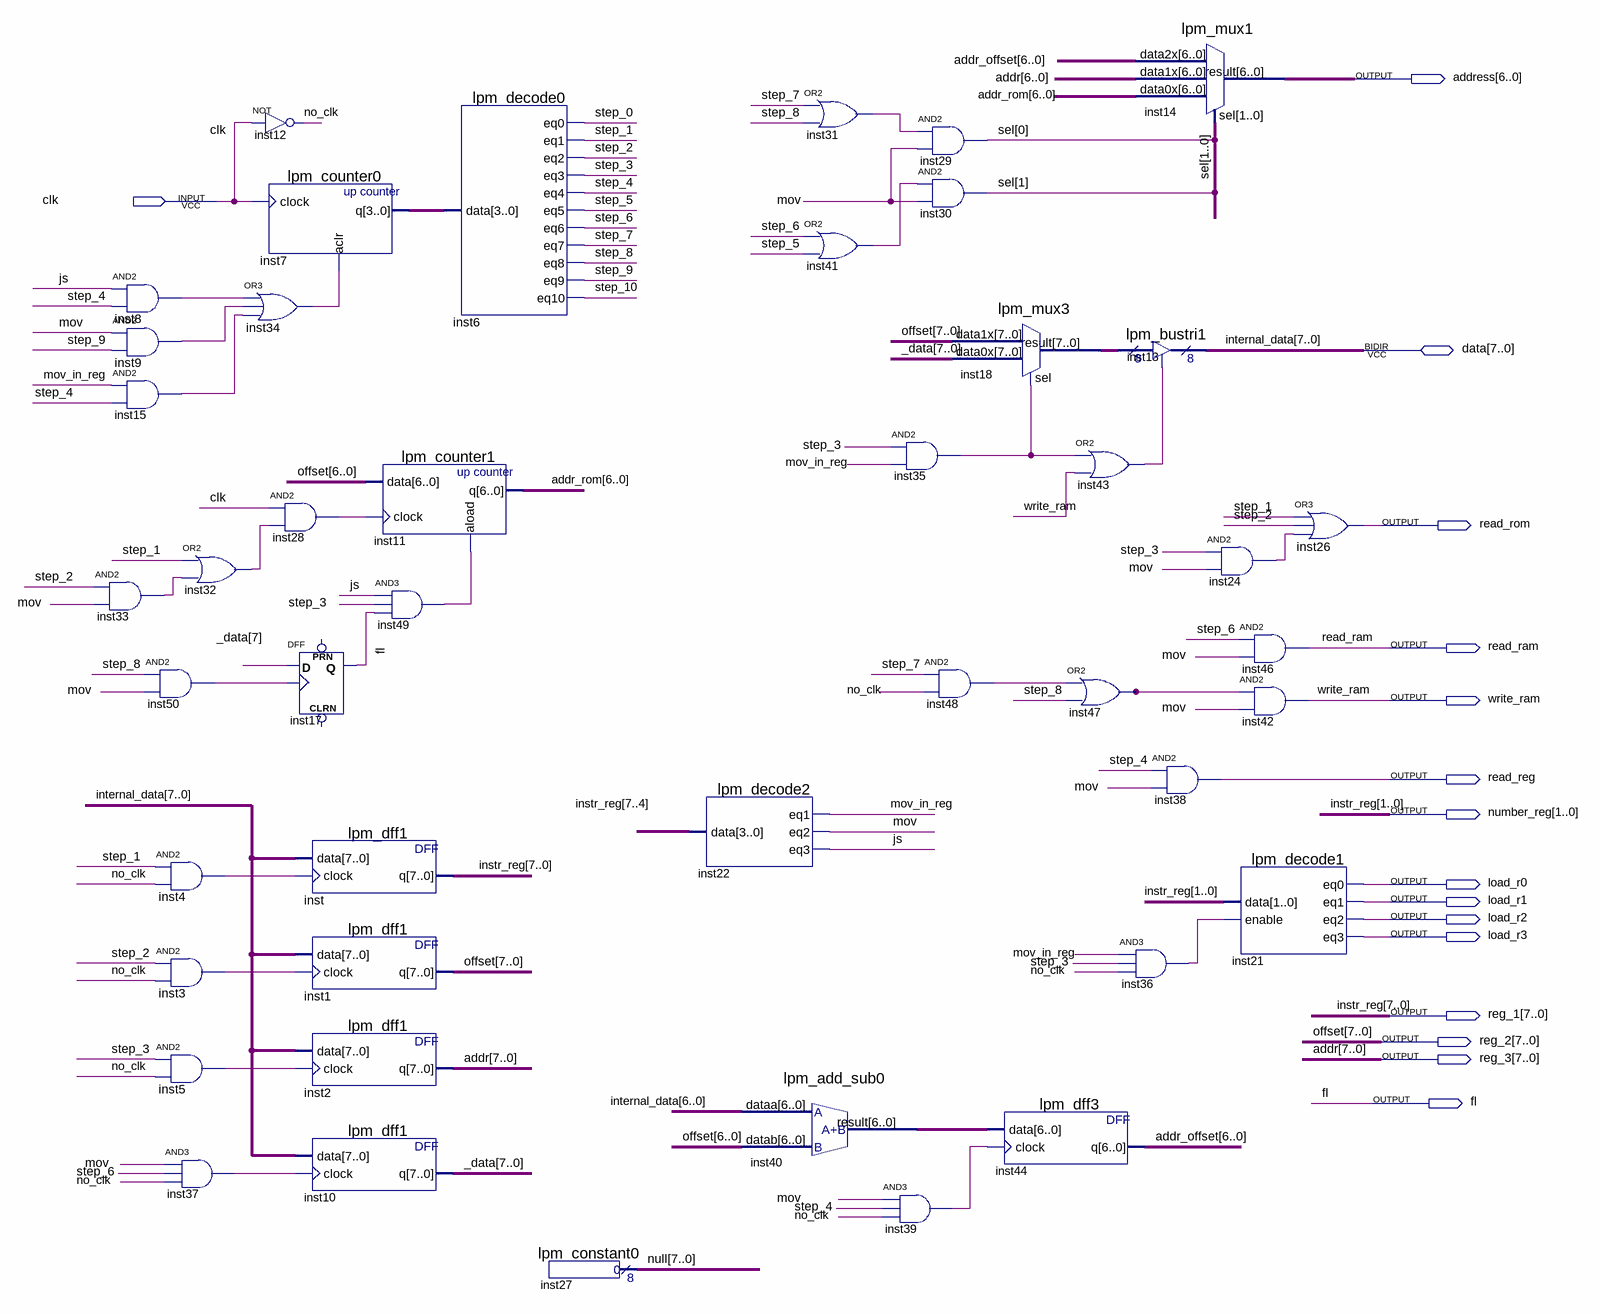
[diagram p0: schematic sheet]
// Quartus schematic cpu.bdf as structural Verilog: 45 symbols, 16 pins
module cpu (
  input  clk,
  inout  [7:0] data,
  output [6:0] address,
  output read_rom,
  output read_ram,
  output write_ram,
  output read_reg,
  output [1:0] number_reg,
  output load_r0,
  output load_r1,
  output load_r2,
  output load_r3,
  output [7:0] reg_1,
  output [7:0] reg_2,
  output [7:0] reg_3,
  output fl
);

  wire inst3_out, inst4_out, inst5_out, inst8_out, inst9_out, inst15_out, inst24_out, inst28_out, inst31_out,
       inst32_out, inst33_out, inst34_out, inst35_out, inst36_out, inst37_out, inst39_out, inst41_out,
       inst43_out, inst47_out, inst48_out, inst49_out, inst50_out, js, mov, mov_in_reg, no_clk, step_0,
       step_1, step_2, step_3, step_4, step_5, step_6, step_7, step_8, step_9, step_10;
  wire [1:0] sel;
  wire [3:0] inst7_q;
  wire [6:0] addr_offset, addr_rom, inst40_result;
  wire [7:0] _data, inst18_result, \null ;

  and inst33 (inst33_out, step_2, mov);
  and inst8 (inst8_out, js, step_4);
  and inst9 (inst9_out, mov, step_9);
  and inst15 (inst15_out, mov_in_reg, step_4);
  and inst50 (inst50_out, step_8, mov);
  and inst4 (inst4_out, step_1, no_clk);
  and inst3 (inst3_out, step_2, no_clk);
  and inst5 (inst5_out, step_3, no_clk);
  and inst37 (inst37_out, mov, step_6, no_clk);
  or inst34 (inst34_out, inst8_out, inst9_out, inst15_out);
  or inst32 (inst32_out, step_1, inst33_out);
  not inst12 (no_clk, clk);
  lpm_counter0 inst7 (.clock(clk), .aclr(inst34_out), .q(inst7_q));
  and inst28 (inst28_out, clk, inst32_out);
  DFF inst17 (.CLK(inst50_out), .D(_data[7]), .Q(fl));  // open: CLRN, PRN
  lpm_dff1 inst (.data(data), .clock(inst4_out), .q({reg_1[7:2], number_reg}));
  lpm_dff1 inst1 (.data(data), .clock(inst3_out), .q(reg_2));
  lpm_dff1 inst2 (.data(data), .clock(inst5_out), .q(reg_3));
  lpm_dff1 inst10 (.data(data), .clock(inst37_out), .q(_data));
  lpm_counter1 inst11 (.data(reg_2[6:0]), .clock(inst28_out), .aload(inst49_out), .q(addr_rom));
  and inst49 (inst49_out, js, step_3, fl);
  lpm_decode0 inst6 (
    .data(inst7_q), .eq0(step_0), .eq1(step_1), .eq2(step_2), .eq3(step_3), .eq4(step_4), .eq5(step_5),
    .eq6(step_6), .eq7(step_7), .eq8(step_8), .eq9(step_9), .eq10(step_10));
  lpm_constant0 inst27 (.result(\null ));
  lpm_decode2 inst22 (.data(reg_1[7:4]), .eq1(mov_in_reg), .eq2(mov), .eq3(js));
  or inst31 (inst31_out, step_7, step_8);
  or inst41 (inst41_out, step_6, step_5);
  lpm_add_sub0 inst40 (.dataa(data[6:0]), .datab(reg_2[6:0]), .result(inst40_result));
  and inst29 (sel[0], inst31_out, mov);
  and inst30 (sel[1], inst41_out, mov);
  and inst35 (inst35_out, step_3, mov_in_reg);
  and inst48 (inst48_out, step_7, no_clk);
  and inst39 (inst39_out, mov, step_4, no_clk);
  lpm_mux3 inst18 (.data1x(reg_2), .data0x(_data), .sel(inst35_out), .result(inst18_result));
  lpm_dff3 inst44 (.data(inst40_result), .clock(inst39_out), .q(addr_offset));
  or inst43 (inst43_out, inst35_out, write_ram);
  or inst47 (inst47_out, inst48_out, step_8);
  lpm_mux1 inst14 (.data2x(addr_offset), .data1x(reg_3[6:0]), .data0x(addr_rom), .sel(sel), .result(address));
  lpm_bustri1 inst13 (.enabledt(inst43_out), .data(inst18_result), .tridata(data));
  and inst38 (read_reg, step_4, mov);
  and inst36 (inst36_out, mov_in_reg, step_3, no_clk);
  and inst24 (inst24_out, step_3, mov);
  lpm_decode1 inst21 (
    .data(number_reg), .enable(inst36_out), .eq0(load_r0), .eq1(load_r1), .eq2(load_r2), .eq3(load_r3));
  or inst26 (read_rom, step_1, step_2, inst24_out);
  and inst46 (read_ram, step_6, mov);
  and inst42 (write_ram, inst47_out, mov);

  assign reg_1[1:0] = number_reg;

  // Other names for the same wires on the sheet: addr[7:0] = reg_3; instr_reg[7:0] = {reg_1[7:2], number_reg};
  //   internal_data[7:0] = data; offset[7:0] = reg_2
endmodule
